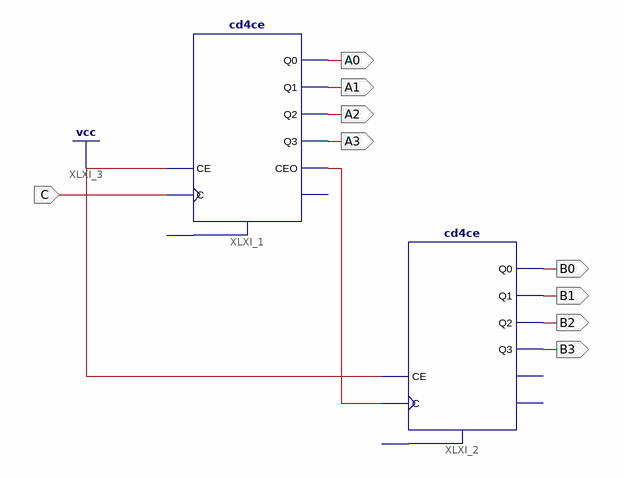
[diagram p0: schematic sheet 1]
// Xilinx ISE schematic Counter.sch (spartan6) as structural Verilog: 2 symbols, 9 ports
module Counter (
  input  C,
  output A0,
  output A1,
  output A2,
  output A3,
  output B0,
  output B1,
  output B2,
  output B3
);

  wire XLXN_18;

  cd4ce XLXI_1 (.C(C), .CE(1'b1), .CEO(XLXN_18), .Q0(A0), .Q1(A1), .Q2(A2), .Q3(A3));  // open: CLR, TC
  cd4ce XLXI_2 (.C(XLXN_18), .CE(1'b1), .Q0(B0), .Q1(B1), .Q2(B2), .Q3(B3));  // open: CLR, CEO, TC
endmodule
